# EAGLE design max3232 (EAGLE 8.2.2)
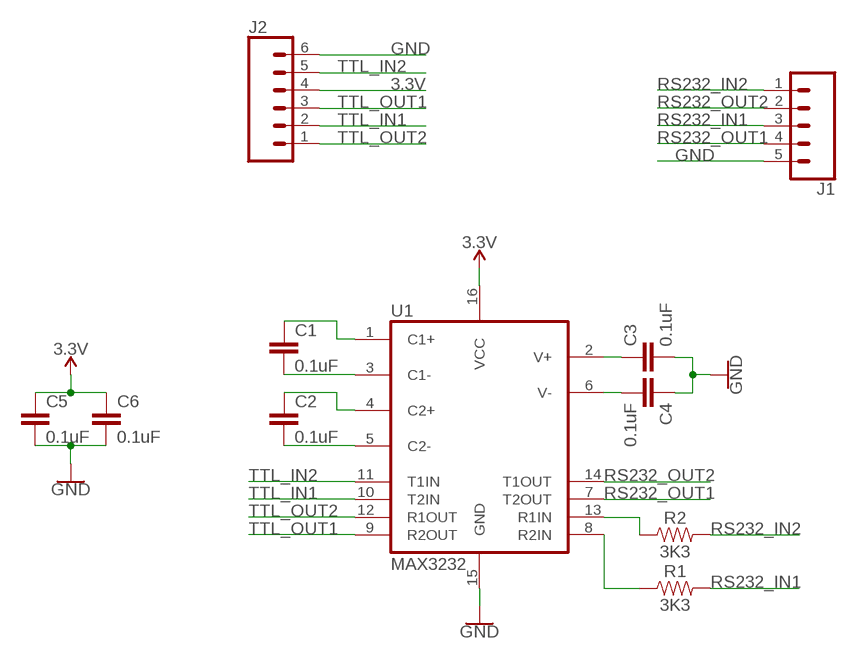
[diagram p0: schematic, sheet 1]

## Parts
C1  0.1uF  1.0UF-0805-25V-(+80/-20%)  [0805]
C2  0.1uF  1.0UF-0805-25V-(+80/-20%)  [0805]
C3  0.1uF  1.0UF-0805-25V-(+80/-20%)  [0805]
C4  0.1uF  1.0UF-0805-25V-(+80/-20%)  [0805]
C5  0.1uF  1.0UF-0805-25V-(+80/-20%)  [0805]
C6  0.1uF  1.0UF-0805-25V-(+80/-20%)  [0805]
J1  CONN_05  [1X05]
J2  CONN_06SILK_FEMALE_PTH  [1X06]
R1  3K3  RESISTOR1206  [1206]
R2  3K3  RESISTOR1206  [1206]
U1  MAX3232  MAX2323SOIC16  [SO16]

## Nets
3.3V: C5.1 C6.1 J2.4 U1.16(VCC)
GND: C3.2 C4.1 C5.2 C6.2 J1.5 J2.6 U1.15(GND)
N$1: C3.1 U1.2(V+)
N$2: C1.2 U1.3(C1-)
N$3: C1.1 U1.1(C1+)
N$4: C2.2 U1.5(C2-)
N$5: C2.1 U1.4(C2+)
N$6: C4.2 U1.6(V-)
N$7: R2.1 U1.13(R1IN)
N$8: R1.1 U1.8(R2IN)
RS232_IN1: J1.3 R1.2
RS232_IN2: J1.1 R2.2
RS232_OUT1: J1.4 U1.7(T2OUT)
RS232_OUT2: J1.2 U1.14(T1OUT)
TTL_IN1: J2.2 U1.10(T2IN)
TTL_IN2: J2.5 U1.11(T1IN)
TTL_OUT1: J2.3 U1.9(R2OUT)
TTL_OUT2: J2.1 U1.12(R1OUT)

## Library data of the parts
C1-C6 = SparkFun-Capacitors:1.0UF: 1µF ceramic capacitors A capacitor is a passive two-terminal electrical component used to store electrical energy temporarily in an electric field.; PROD_ID: CAP-11625; VALUE: 1.0uF
J1 = SparkFun-Connectors:CONN_05: Multi connection point. Often used as Generic Header-pin footprint for 0.1 inch spaced/style header connections On any of the 0.1 inch spaced packages, you can populate with these: Break Away Headers - Straight <https://www.sparkfun.com/products/116> (PRT-00116) Break Away Male Headers - Right Angle <https://www.sparkfun.com/products/553> (PRT-00553) Female Headers <https://www.sparkfun.com/products/115> (PRT-00115) Break Away Headers - Machine Pin <https://www.sparkfun.com/products/117> (PRT-00117) Break Away Female Headers - Swiss Machine Pin <https://www.sparkfun.com/products/743> (PRT-00743) For SCREWTERMINALS and SPRING TERMINALS visit here: Screw Terimnals on SparkFun.com <https://www.sparkfun.com/search/results?term=Screw+Terminals> (5mm/3.5mm/2.54mm spacing) This device is also useful as a general connection point to wire up your design to another part of your project. Our various solder wires solder well into these plated through hole pads. Hook-Up Wire - Assortment (Stranded, 22 AWG) <https://www.sparkfun.com/products/11375> (PRT-11375) Hook-Up Wire - Assortment (Solid Core, 22 AWG) <https://www.sparkfun.com/products/11367> (PRT-11367) View the entire wire category on our website here <https://www.sparkfun.com/categories/141> Special notes: Molex polarized connector foot print use with SKU : PRT-08231 with associated crimp pins and housings. 1MM SMD Version SKU: PRT-10208
J2 = SparkFun-Connectors:CONN_06: Multi connection point. Often used as Generic Header-pin footprint for 0.1 inch spaced/style header connections On any of the 0.1 inch spaced packages, you can populate with these: Break Away Headers - Straight <https://www.sparkfun.com/products/116> (PRT-00116) Break Away Male Headers - Right Angle <https://www.sparkfun.com/products/553> (PRT-00553) Female Headers <https://www.sparkfun.com/products/115> (PRT-00115) Break Away Headers - Machine Pin <https://www.sparkfun.com/products/117> (PRT-00117) Break Away Female Headers - Swiss Machine Pin <https://www.sparkfun.com/products/743> (PRT-00743) Arduino Stackable Header - 6 Pin <https://www.sparkfun.com/products/9280> (PRT-09280) For SCREWTERMINALS and SPRING TERMINALS visit here: Screw Terimnals on SparkFun.com <https://www.sparkfun.com/search/results?term=Screw+Terminals> (5mm/3.5mm/2.54mm spacing) This device is also useful as a general connection point to wire up your design to another part of your project. Our various solder wires solder well into these plated through hole pads. Hook-Up Wire - Assortment (Stranded, 22 AWG) <https://www.sparkfun.com/products/11375> (PRT-11375) Hook-Up Wire - Assortment (Solid Core, 22 AWG) <https://www.sparkfun.com/products/11367> (PRT-11367) View the entire wire category on our website here <https://www.sparkfun.com/categories/141>; PROD_ID: CONN-08437
R1 R2 = SparkFun-Resistors:RESISTOR: Generic Resistor Package
U1 = SparkFun-IC-Comms:MAX2323: RS232 Transceiver This part covers 232 drivers that are compatible with the MAX3232. Sipex SP3232EB Datasheet <http://cdn.sparkfun.com/datasheets/Components/General%20IC/SP3232EBCA-L.pdf> SparkFun Products SOIC component <https://www.sparkfun.com/products/589> (COM-00589 / IC-08171) Retired DIP component (COM-00316 / IC-08446) SparkFun Transceiver Breakout - MAX3232 <https://www.sparkfun.com/products/11189> (BOB-11189) SparkFun XBee Explorer Serial <https://www.sparkfun.com/products/13225> (WRL-13225); PROD_ID: IC-08171

## Board
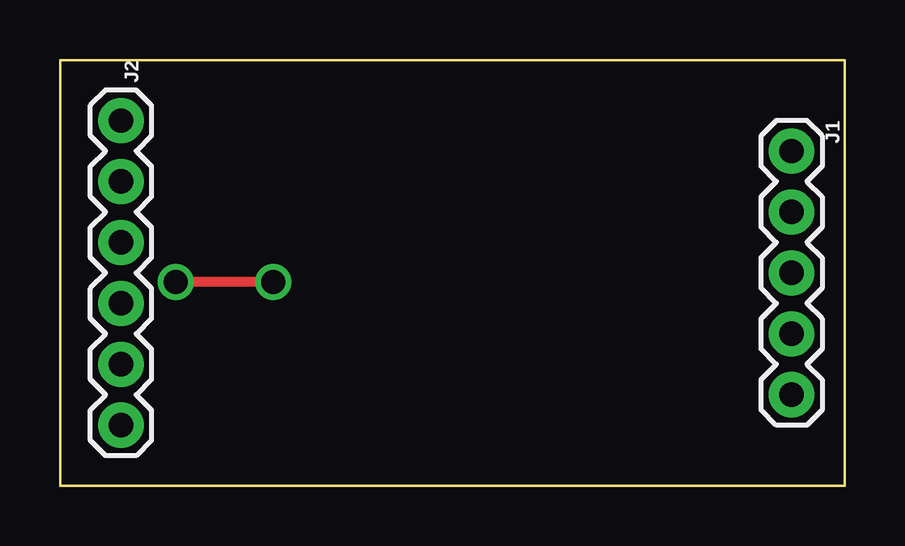
[diagram p1: board, top side]
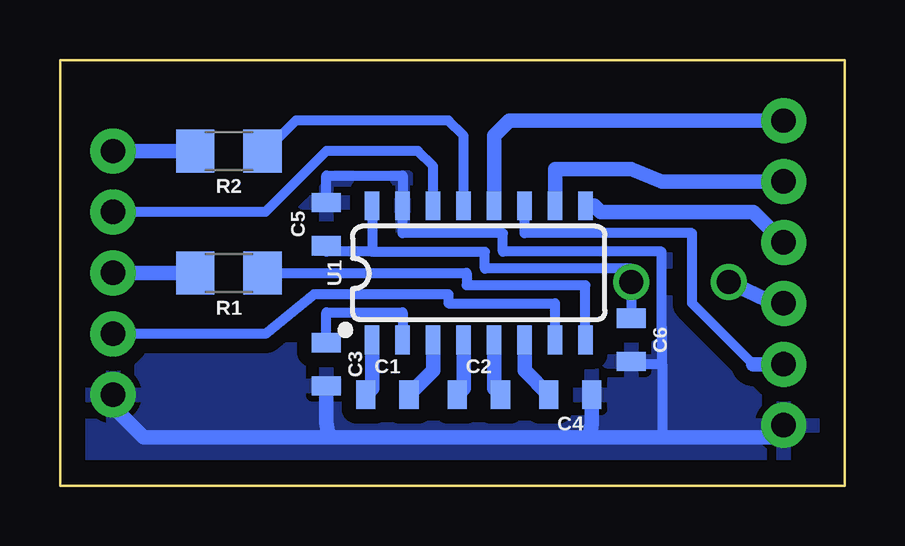
[diagram p2: board, bottom side, seen from below]

Size 32.69 x 17.77 mm. Coordinates in mm from the lower left corner, seen from the top.
Outline: 0,0 32.69,0 32.69,17.77 0,17.77 0,0
Copper layers (1*16): Top 0.035mm / dielectric 1.5mm / Bottom 0.035mm
Design rules "default": minimum track width 6mil, minimum drill 0.35mm, track to track 6mil, track to pad 6mil, pad to pad 6mil, via to via 6mil, smd to smd 6mil, copper to edge 40mil, drill to drill 6mil, minimum pad ring 10mil, minimum via ring 8mil, stop-mask expansion 4mil, vias tented up to drill 0mil, thermal gap 10mil

### Footprints (pad centres in the part's own frame; a part is rotated, then mirrored left to right if it is on the bottom)
0805 = smd 0.8 x 1.2: 1 -0.9,0; 2 0.9,0
1X05 = drill 1.016 pad 1.88: 1 0,0; 2 2.54,0; 3 5.08,0; 4 7.62,0; 5 10.16,0
1X06 = drill 1.016 pad 1.88: 1 0,0; 2 2.54,0; 3 5.08,0; 4 7.62,0; 5 10.16,0; 6 12.7,0
1206 = smd 1.6 x 1.8: 1 -1.4,0; 2 1.4,0
SO16 = smd 0.6 x 1.2: 1 -4.445,-2.8; 2 -3.175,-2.8; 3 -1.905,-2.8; 4 -0.635,-2.8; 5 0.635,-2.8; 6 1.905,-2.8; 7 3.175,-2.8; 8 4.445,-2.8; 9 4.445,2.8; 10 3.175,2.8; 11 1.905,2.8; 12 0.635,2.8; 13 -0.635,2.8; 14 -1.905,2.8; 15 -3.175,2.8; 16 -4.445,2.8

### Placement (x,y rotation side)
C1  19.05,3.81 0 bottom
C2  15.24,3.81 0 bottom
C3  21.59,5.08 270 bottom
C4  11.43,3.81 180 bottom
C5  21.59,10.92 90 bottom
C6  8.89,6.1 270 bottom
J1  30.48,13.97 270 top
J2  2.54,15.24 270 top
R1  25.65,8.89 180 bottom
R2  25.65,13.97 180 bottom
U1  15.24,8.89 0 bottom

### Tracks (layer width: path | path; a pad name or v marks a point on that pad's centre or on a via)
3.3V  (via drill 1)
  Top 0.406: v8.89,8.51 v4.83,8.51
  Bottom 0.406: 9.08,9.08 8.89,9.07 | C6.1 v8.89,8.51 8.89,9.07 | 8.89,9.07 14.99,9.07 14.99,9.78 19.68,9.78 | C5.1 21.59,9.78 19.68,9.78 | U1.16 19.68,9.78
  Bottom 0.61: v4.83,8.51 2.92,7.62 J2.4
GND
  Bottom 0.406: U1.15 18.41,12.06 | C5.2 21.59,12.95 18.41,12.95 U1.15 | 7.6,5.1 7.6,6.6 7.62,6.6 7.62,9.78 14.23,9.78 14.23,10.54 18.41,10.54 U1.15 | 7.6,5.1 7.6,2.03 | 8.79,5.1 7.6,5.1
  Bottom 0.61: 21.48,2.03 10.61,2.03 | 21.48,2.03 29.21,2.03 30.48,3.3 J1.5 | 10.61,2.03 7.6,2.03 2.72,2.03 2.72,2.36 J2.6 | C4.1 10.53,2.62 10.61,2.03 | C3.2 21.59,2.65 21.48,2.03 | C6.2 8.79,5.1
  pour Bottom (isolate 0.61): 0,17.78 33.02,17.78 33.02,0 0,0
N$1
  Bottom 0.406: C3.1 21.59,7.24 18.41,7.24 U1.2
N$2
  Bottom 0.61: 17.14,5.71 U1.3 17.14,4.82 C1.2
N$3
  Bottom 0.61: U1.1 19.68,4.08 C1.1
N$4
  Bottom 0.61: U1.5 14.61,4.08 C2.2
N$5
  Bottom 0.61: U1.4 15.88,4.08 C2.1
N$6
  Bottom 0.61: U1.6 13.34,4.82 C4.2
N$7
  Bottom 0.406: U1.13 15.88,14.61 16.51,15.24 22.86,15.24 24.13,13.97 R2.1
N$8
  Bottom 0.406: U1.8 10.79,8.38 15.75,8.38 15.75,8.89 R1.1
RS232_IN1
  Bottom 0.61: R1.2 J1.3
RS232_IN2
  Bottom 0.61: R2.2 J1.1
RS232_OUT1
  Bottom 0.406: J1.4 24.13,6.35 22.1,8 16.51,8 16.51,7.62 12.06,7.62 U1.7
RS232_OUT2
  Bottom 0.406: U1.14 17.14,13.34 17.78,13.97 21.59,13.97 24.13,11.43 J1.2
TTL_IN1
  Bottom 0.61: U1.10 12.06,13.21 8.89,13.21 7.62,12.7 J2.2
TTL_IN2
  Bottom 0.406: 3.81,5.08 6.35,7.62 6.35,10.54 13.34,10.54 U1.11
  Bottom 0.61: 3.81,5.08 J2.5
TTL_OUT1
  Bottom 0.61: U1.9 10.42,11.69 10.16,11.43 3.81,11.43 J2.3
TTL_OUT2
  Bottom 0.61: U1.12 14.61,14.61 13.97,15.24 J2.1

### Text on the board
tDocu: RS232 | TTL | RTS<- / CTS-> / RX<- / TX-> / GND | <-RTS / ->RX / <-TX / 3V3 / ->CTS / GND